# Altium schematic sheet NRF24L01_test_node.SchDoc
size A4
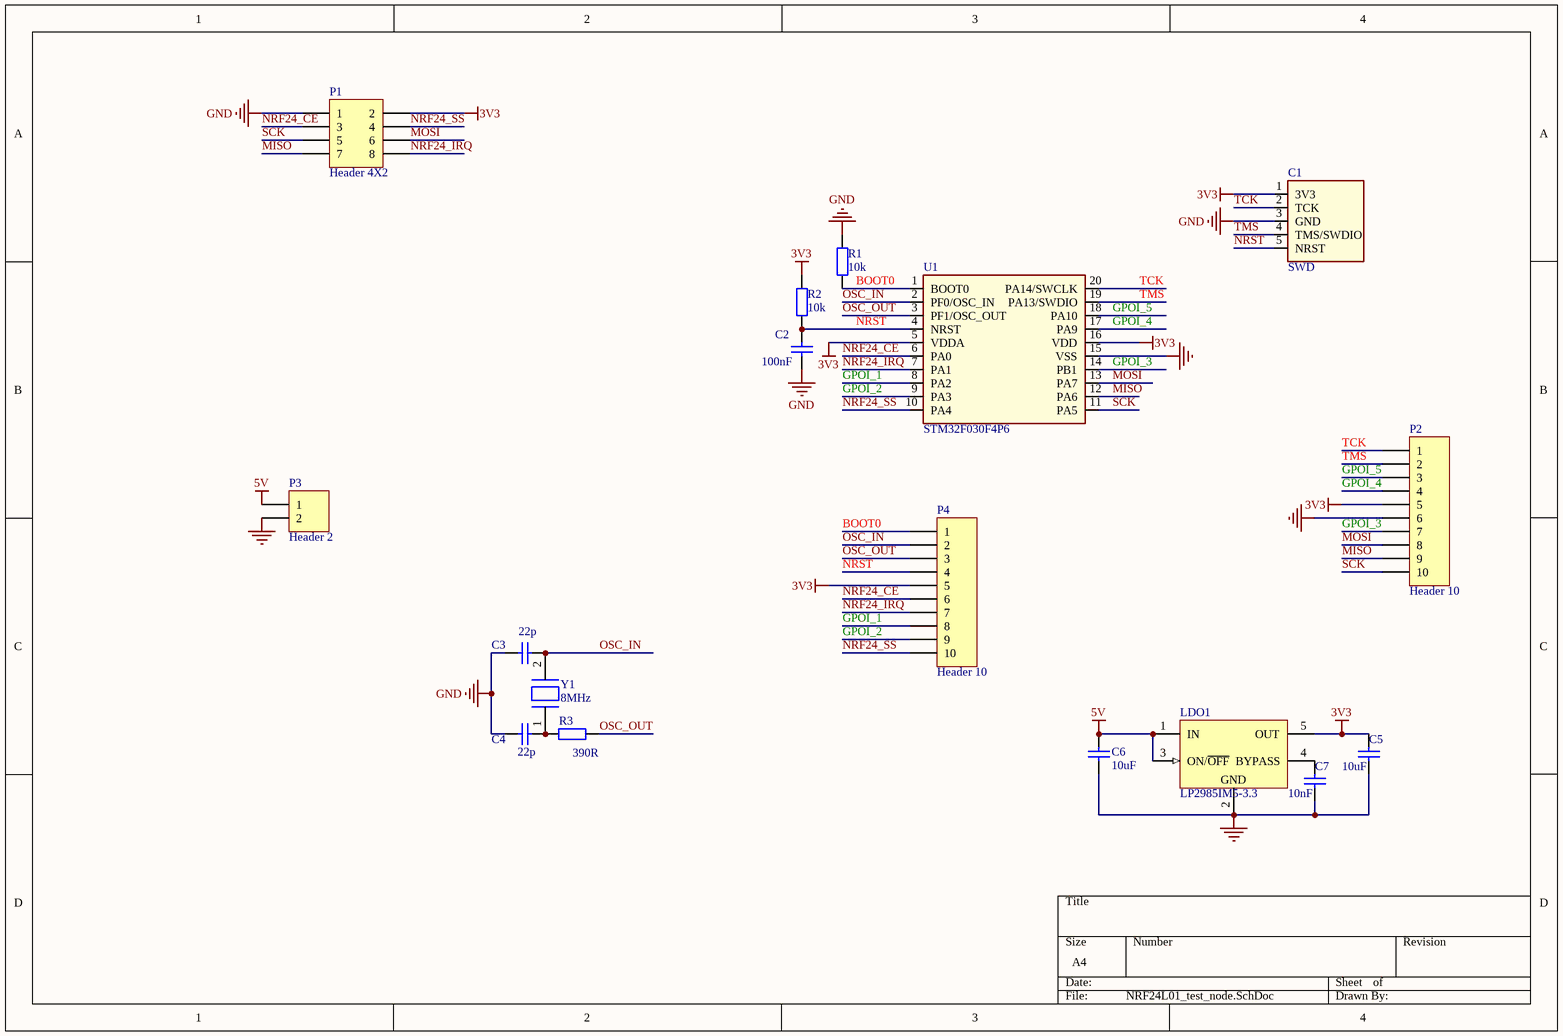
[diagram p0: NRF24L01_test_node.SchDoc]

## Parts
C1  SWD  [SWD]
C2  100nF  [FP_0603_CAP_080]
C3  22p  [FP_0603_CAP_080]
C4  22p  [FP_0603_CAP_080]
C5  10uF  [FP_0603_CAP_080]
C6  10uF  [FP_0603_CAP_080]
C7  10nF  [FP_0603_CAP_080]
LDO1  LP2985IM5-3.3  [SUPPLY_SOT23-5]
P1  Header 4X2  [FP_CONN8_SZK_ALLO]
P2  Header 10  [HDR1X10]
P3  Header 2  [HDR1X2]
P4  Header 10  [HDR1X10]
R1  10k  [FP_0603_RES]
R2  10k  [FP_0603_RES]
R3  390R  [FP_0603_RES]
U1  STM32F030F4P6  [uC_TSSOP20]
Y1  value 8MHz  [FP_CRYSTAL_HC49_SMD]  (hidden comment: 8MHz Quartz HC49)

## Nets
3V3: C1.1(3V3) C5.2 LDO1.5(OUT) P1.2 P2.5 P4.5 R2.1 U1.5(VDDA) U1.16(VDD)
5V: C6.2 LDO1.1(IN) LDO1.3(ON/~{OFF}) P3.1
GND: C1.3(GND) C2.2 C3.1 C4.1 C5.1 C6.1 C7.1 LDO1.2(GND) P1.1 P2.6 P3.2 R1.1 U1.15(VSS)
BOOT0: P4.1 R1.2 U1.1(BOOT0)
GPOI_1: P4.8 U1.8(PA2)
GPOI_2: P4.9 U1.9(PA3)
GPOI_3: P2.7 U1.14(PB1)
GPOI_4: P2.4 U1.17(PA9)
GPOI_5: P2.3 U1.18(PA10)
MISO: P1.7 P2.9 U1.12(PA6)
MOSI: P1.6 P2.8 U1.13(PA7)
NRF24_CE: P1.3 P4.6 U1.6(PA0)
NRF24_IRQ: P1.8 P4.7 U1.7(PA1)
NRF24_SS: P1.4 P4.10 U1.10(PA4)
NRST: C1.5(NRST) C2.1 P4.4 R2.2 U1.4(NRST)
OSC_IN: C3.2 P4.2 U1.2(PF0/OSC_IN) Y1.2
OSC_OUT: P4.3 R3.1 U1.3(PF1/OSC_OUT)
SCK: P1.5 P2.10 U1.11(PA5)
TCK: C1.2(TCK) P2.1 U1.20(PA14/SWCLK)
TMS: C1.4(TMS/SWDIO) P2.2 U1.19(PA13/SWDIO)
NetC4_2: C4.2 R3.2 Y1.1
NetC7_2: C7.2 LDO1.4(BYPASS)

## Library data of the parts
C1 = SWD: ARM SWD connector
C2-C4 = Cap: Capacitor; Order info: TODO; Tûrés: 10%
  C2: Value: 100nF
  C3 C4: Value: 22p
C5-C7 = Cap: Capacitor; Order info: Ültetõ cég adja; Tûrés: 10%
  C5 C6: Value: 10uF
  C7: Value: 10nF
LDO1 = LP2985: Micropower 150 mA Ultra Low-Dropout Regulator In SOT-23/6 and micro SMD Packages; Order info: lomex: 89-08-85
P1 = Header 4X2: Header, 4-Pin, Dual row; LatestRevisionDate: 17-Jul-2002; LatestRevisionNote: Re-released for DXP Platform.; Publisher: Altium Limited
P2 P4 = Header 10: Header, 10-Pin; LatestRevisionDate: 17-Jul-2002; LatestRevisionNote: Re-released for DXP Platform.; Publisher: Altium Limited
P3 = Header 2: Header, 2-Pin; LatestRevisionDate: 17-Jul-2002; LatestRevisionNote: Re-released for DXP Platform.; Publisher: Altium Limited
R1-R3 = Res3: Resistor; Order info: TODO; Tûrés: 5%
  R1 R2: Value: 10k
  R3: Value: 390R
U1 = STM32F030F4P6: MCU 32-bit STM32F ARM Cortex M0 RISC 16KB Flash 2.5V/3.3V 20-Pin TSSOP
Y1 = XTAL HC49: Standard HC49 quartz; Order info: ugyanaz mint a feden